# EAGLE design Comp PDU (EAGLE 9.5.2)
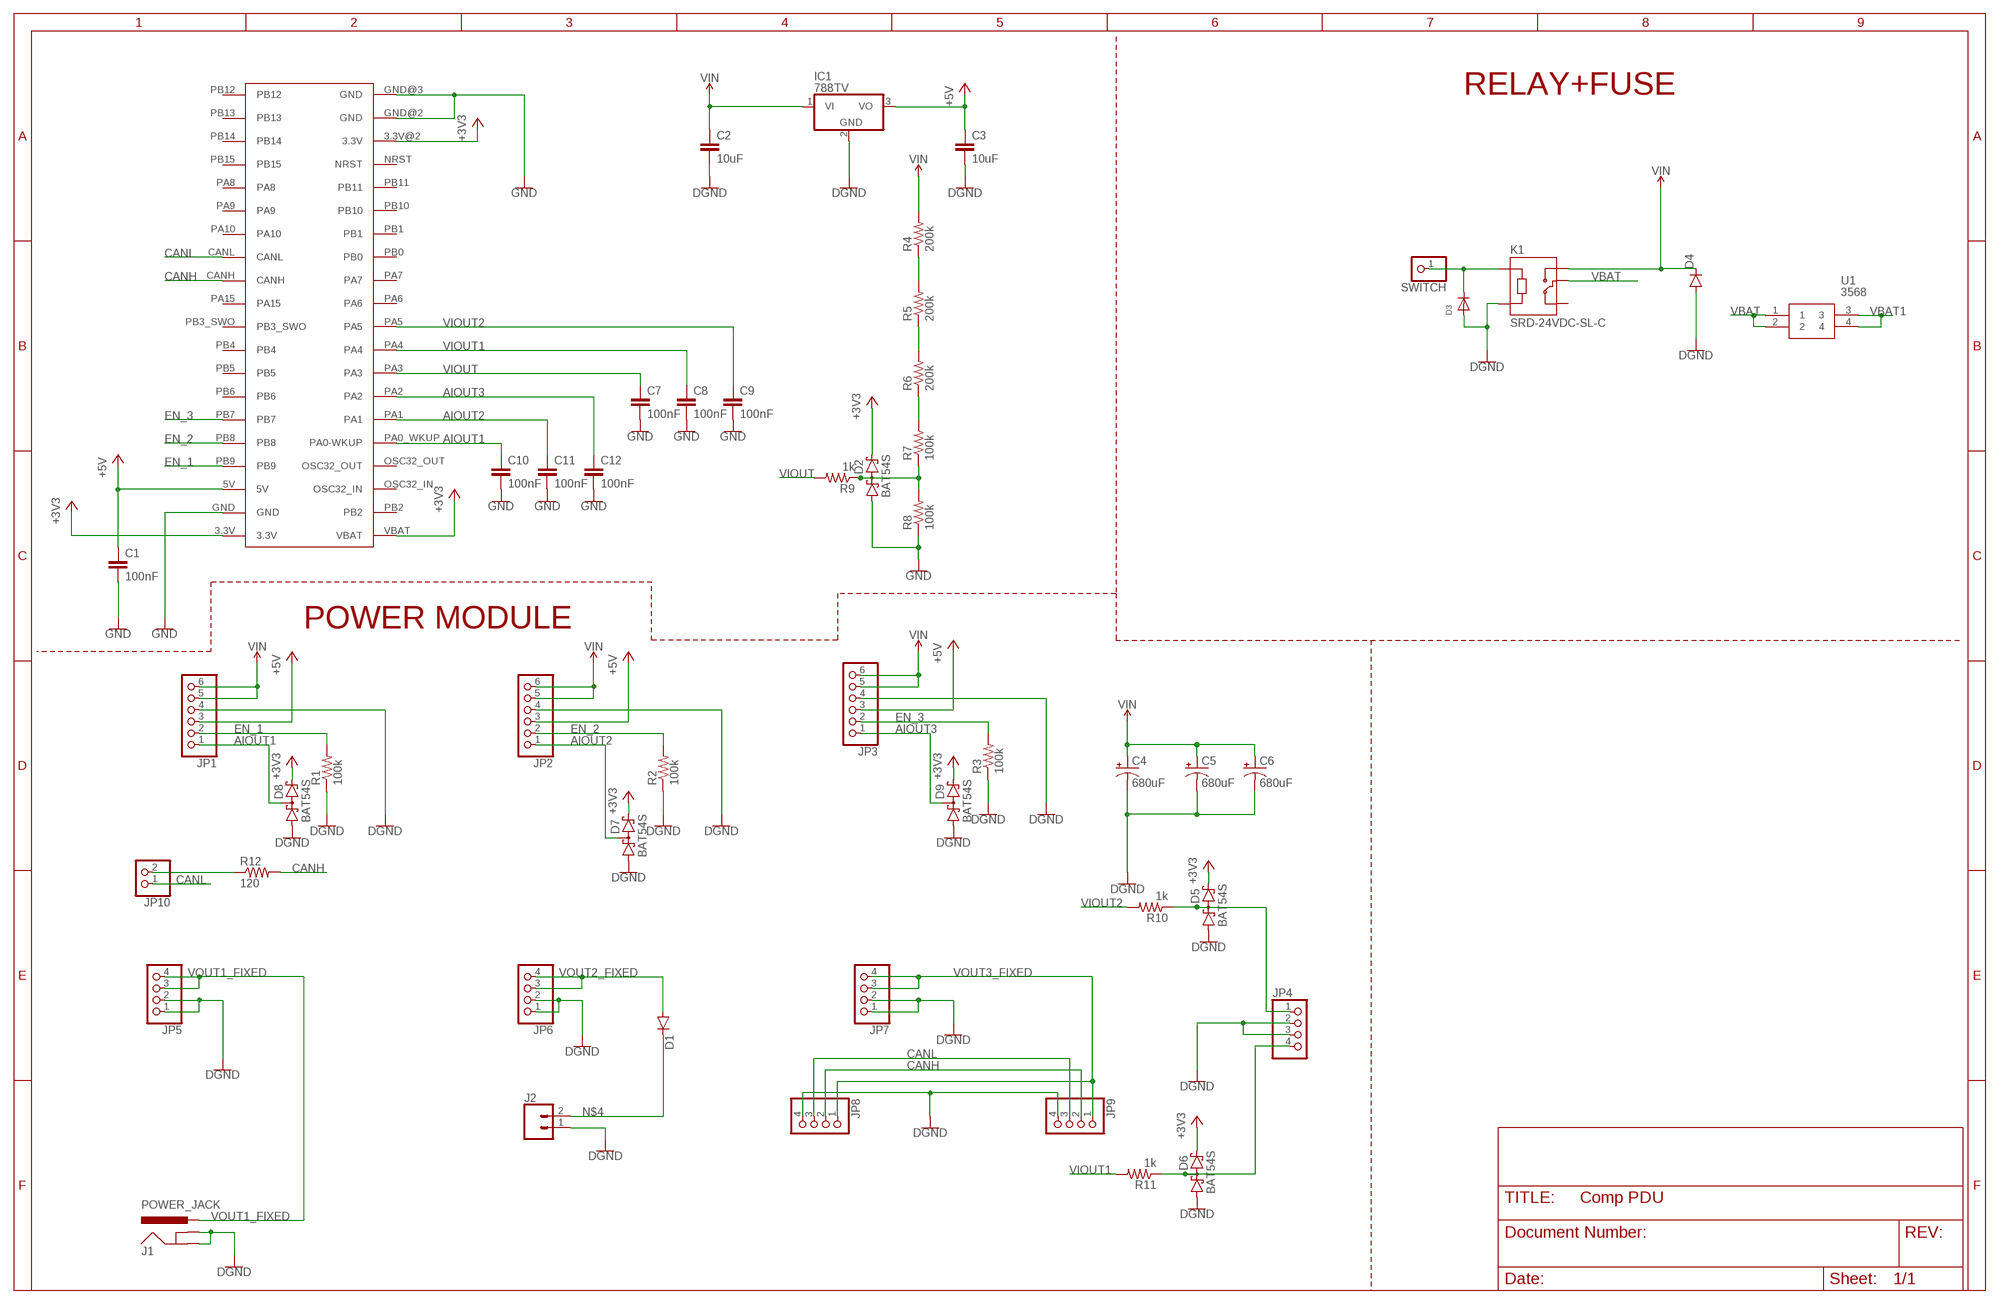
[diagram p0: schematic, sheet 1]

## Parts
C1  100nF  C-EUC0805  [C0805]
C2  10uF  C-EUC1206  [C1206]
C3  10uF  C-EUC1206  [C1206]
C4  680uF  CPOL-USE5-10.5  [E5-10,5]
C5  680uF  CPOL-USE5-10.5  [E5-10,5]
C6  680uF  CPOL-USE5-10.5  [E5-10,5]
C7  100nF  C-EUC0805  [C0805]
C8  100nF  C-EUC0805  [C0805]
C9  100nF  C-EUC0805  [C0805]
C10  100nF  C-EUC0805  [C0805]
C11  100nF  C-EUC0805  [C0805]
C12  100nF  C-EUC0805  [C0805]
D1  DIODE-DO214AA  [DO214AA]
D2  BAT54S  [SOT23]
D3  DIODEDO-1N4148  [DO-1N4148]
D4  DIODE-DO-214AC  [DO-214AC]
D5  BAT54S  [SOT23]
D6  BAT54S  [SOT23]
D7  BAT54S  [SOT23]
D8  BAT54S  [SOT23]
D9  BAT54S  [SOT23]
IC1  788TV  [TO220V]
J1  POWER_JACK  [POWER_JACK_PTH]
J2  CONN_025MM  [SCREWTERMINAL-5MM-2]
JP1  PINHD-1X6  [1X06]
JP2  PINHD-1X6  [1X06]
JP3  PINHD-1X6  [1X06]
JP4  PINHD-1X4  [1X04]
JP5  PINHD-1X4  [1X04]
JP6  PINHD-1X4  [1X04]
JP7  PINHD-1X4  [1X04]
JP8  PINHD-1X4  [1X04]
JP9  PINHD-1X4  [1X04]
JP10  PINHD-1X2  [1X02]
K1  SRD-24VDC-SL-C  SRD-05VDC-SL-C  [RELAY_SRD-05VDC-SL-C]
R1  100k  R-US_R0805  [R0805]
R2  100k  R-US_R0805  [R0805]
R3  100k  R-US_R0805  [R0805]
R4  200k  R-US_R0805  [R0805]
R5  200k  R-US_R0805  [R0805]
R6  200k  R-US_R0805  [R0805]
R7  100k  R-US_R0805  [R0805]
R8  100k  R-US_R0805  [R0805]
R9  1k  R-US_R0805  [R0805]
R10  1k  R-US_R0805  [R0805]
R11  1k  R-US_R0805  [R0805]
R12  120  R-US_R0805  [R0805]
SWITCH  PINHD-1X1  [1X01]
U1  3568  [3568]
U$1  STM-DEV-BOARD  [STM-DEV-BOARD]

## Nets
+3V3: D2.2(C2) D5.2(C2) D6.2(C2) D7.2(C2) D8.2(C2) D9.2(C2) U$1.3.3V U$1.3.3V@2(3.3V) U$1.VBAT
+5V: C1.1 C3.1 IC1.3(VO) JP1.3 JP2.3 JP3.3 U$1.5V
AIOUT1: C10.1 D8.3(C1A2) JP1.1 U$1.PA0_WKUP(PA0-WKUP)
AIOUT2: C11.1 D7.3(C1A2) JP2.1 U$1.PA1
AIOUT3: C12.1 D9.3(C1A2) JP3.1 U$1.PA2
CANH: JP8.2 JP9.2 R12.2 U$1.CANH
CANL: JP8.3 JP9.3 JP10.1 U$1.CANL
EN_1: JP1.2 R1.2 U$1.PB9
EN_2: JP2.2 R2.2 U$1.PB8
EN_3: JP3.2 R3.2 U$1.PB7
GND: C1.2 C2.2 C3.2 C4.- C5.- C6.- C7.2 C8.2 C9.2 C10.2 C11.2 C12.2 D2.1(A1) D3.A D4.A D5.1(A1) D6.1(A1) D7.1(A1) D8.1(A1) D9.1(A1) IC1.2(GND) J1.GND J1.GNDBREAK J2.1 JP1.4 JP2.4 JP3.4 JP4.2 JP4.3 JP5.1 JP5.2 JP6.1 JP6.2 JP7.1 JP7.2 JP8.4 JP9.4 K1.A2 R1.1 R2.1 R3.1 R8.1 U$1.GND U$1.GND@2(GND) U$1.GND@3(GND) ; supply symbol labelled DGND
N$1: R4.1 R5.2
N$2: R5.1 R6.2
N$3: R6.1 R7.2
N$4: D1.C J2.2
N$5: D2.3(C1A2) R7.1 R8.2 R9.1
N$6: JP10.2 R12.1
N$7: D3.C K1.A1 SWITCH.1
N$9: D6.3(C1A2) JP4.4 R11.1
N$13: D5.3(C1A2) JP4.1 R10.1
VBAT: K1.COM U1.1 U1.2
VBAT1: U1.3 U1.4
VIN: C2.1 C4.+ C5.+ C6.+ D4.C IC1.1(VI) JP1.5 JP1.6 JP2.5 JP2.6 JP3.5 JP3.6 K1.NO R4.2
VIOUT: C7.1 R9.2 U$1.PA3
VIOUT1: C8.1 R11.2 U$1.PA4
VIOUT2: C9.1 R10.2 U$1.PA5
VOUT1_FIXED: J1.PWR JP5.3 JP5.4
VOUT2_FIXED: D1.A JP6.3 JP6.4
VOUT3_FIXED: JP7.3 JP7.4 JP8.1 JP9.1
Unconnected: K1.NC U$1.NRST U$1.OSC32_IN U$1.OSC32_OUT U$1.PA6 U$1.PA7 U$1.PA8 U$1.PA9 U$1.PA10 U$1.PA15 U$1.PB0 U$1.PB1 U$1.PB2 U$1.PB3_SWO U$1.PB4 U$1.PB5 U$1.PB6 U$1.PB10 U$1.PB11 U$1.PB12 U$1.PB13 U$1.PB14 U$1.PB15

## Notes on the sheet
- RELAY+FUSE
- POWER MODULE

## Library data of the parts
C1-C3 C7-C12 = rcl:C-EU: CAPACITOR, European symbol; SPICEPREFIX: C
C4-C6 = rcl:CPOL-US: POLARIZED CAPACITOR, American symbol; SPICEPREFIX: C
D1 D4 = diode:DIODE-: DIODE
D2 D5-D9 = diode:BAT54S: Schottky Diodes Pin connection corrected 2011-05-04 Source: Fairchild .. BAT54.pdf
D3 = adafruit:DIODE: Diode SMADIODE - SMA Surface Mount Package 20V 1A Schottky Diode Digikey: 641-1014-6-ND DO-1N4148 - Through Hole Small Current Diode SOD-123 20V 1 A (.5mV Vf) Schottky Diode - Digikey: MBRX120TPMSCT-ND SOD-323 10V 570mA (.38mV Vf, 3ns) Schottky Diode - Digikey: ZLLS410CT-ND SOD-523 30V 30mA Schottky Diode (RB751S-40TE61) - Digikey: RB751S-40TE61CT-ND SOT23-R/W - SOT23 Package (R = Solder Paste/Reflow Ovens, W = Hand-Soldering) BAT54Film 40V 300mA - Digikey: 497-7162-1-ND
IC1 = linear:78*: Positive VOLTAGE REGULATOR Source: http://cache.national.com/ds/LM/LM78L05.pdf http://www.fairchildsemi.com/ds/LM/LM7805.pdf
J1 = SparkFun-Connectors:POWER_JACK: Power Jack Connector This is the standard 5.5mm barrel jack for power. The PTH is the most common, proven, reliable, footprint. The Slot footprint only works if the mill layer is transmitted to the PCB fab house so be warned. Here are the connectors we sell at SparkFun: DC Barrel Power Jack/Connector <https://www.sparkfun.com/products/119> (PRT-00119) DC Barrel Power Jack/Connector (SMD) <https://www.sparkfun.com/products/12748> (PRT-12748) DC Barrel Jack Adapter - Breadboard Compatible <https://www.sparkfun.com/products/10811> (PRT-10811) It is used on this SparkFun product (and many, many others): SparkFun RedBoard - Programmed with Arduino <https://www.sparkfun.com/products/12757> (DEV-12757) Also, if you need a mating power supply or connector, please check these out: Wall Adapter Power Supply - 9VDC 650mA <https://www.sparkfun.com/products/298> (TOL-00298) DC Barrel Jack Adapter - Male <https://www.sparkfun.com/products/10287> (PRT-10287); PROD_ID: CONN-08197
J2 = SparkFun-Connectors:CONN_02: Multi connection point. Often used as Generic Header-pin footprint for 0.1 inch spaced/style header connections On any of the 0.1 inch spaced packages, you can populate with these: Break Away Headers - Straight <https://www.sparkfun.com/products/116> (PRT-00116) Break Away Male Headers - Right Angle <https://www.sparkfun.com/products/553> (PRT-00553) Female Headers <https://www.sparkfun.com/products/115> (PRT-00115) Break Away Headers - Machine Pin <https://www.sparkfun.com/products/117> (PRT-00117) Break Away Female Headers - Swiss Machine Pin <https://www.sparkfun.com/products/743> (PRT-00743) For SCREWTERMINALS and SPRING TERMINALS visit here: Screw Terimnals on SparkFun.com <https://www.sparkfun.com/search/results?term=Screw+Terminals> (5mm/3.5mm/2.54mm spacing) This device is also useful as a general connection point to wire up your design to another part of your project. Our various solder wires solder well into these plated through hole pads. Hook-Up Wire - Assortment (Stranded, 22 AWG) <https://www.sparkfun.com/products/11375> (PRT-11375) Hook-Up Wire - Assortment (Solid Core, 22 AWG) <https://www.sparkfun.com/products/11367> (PRT-11367) View the entire wire category on our website here <https://www.sparkfun.com/categories/141> Special notes: Molex polarized connector foot print use with: PRT-08233 with associated crimp pins and housings. 2.54_SCREWTERM for use with PRT-10571. 3.5mm Screw Terminal footprints for PRT-08084 5mm Screw Terminal footprints for use with PRT-08432; SF_SKU: PRT-08432
JP1-JP3 = pinhead:PINHD-1X6: PIN HEADER
JP4-JP9 = pinhead:PINHD-1X4: PIN HEADER
JP10 = pinhead:PINHD-1X2: PIN HEADER
K1 = SPEAR:SRD-05VDC-SL-C: 5V Trigger Relay Module For Arduino And Raspberry Pi 5V Trigger Relay Module For Arduino And Raspberry Pi; AVAILABILITY: Unavailable; DESCRIPTION: 5V Trigger Relay Module For Arduino And Raspberry Pi 5V Trigger Relay Module For Arduino And Raspberry Pi; MF: Songle Relay; MP: SRD-05VDC-SL-C; PACKAGE: None; PRICE: None
R1-R12 = rcl:R-US_: RESISTOR, American symbol; SPICEPREFIX: R
SWITCH = pinhead:PINHD-1X1: PIN HEADER
U1 = LCSC:3568: Fuse Holder .63 MINI FUSE HOLDER Source: Datasheet <http://www.keyelco.com/product-pdf.cfm?p=306>; ALLIED_NUMBER: 70182434; ALLIED_PRICE-STOCK: http://www.alliedelec.com/keystone-electronics-3568/70182434/; DESCRIPTION: Fuse Holder .63 MINI FUSE HOLDER; HEIGHT: 7.37mm; MANUFACTURER_NAME: Keystone Electronics; MANUFACTURER_PART_NUMBER: 3568; MOUSER_PART_NUMBER: 534-3568; MOUSER_PRICE-STOCK: https://www.mouser.com/Search/Refine.aspx?Keyword=534-3568
U$1 = SPEAR:STM-DEV-BOARD: STM Dev board device for SPEAR custom board

## Board
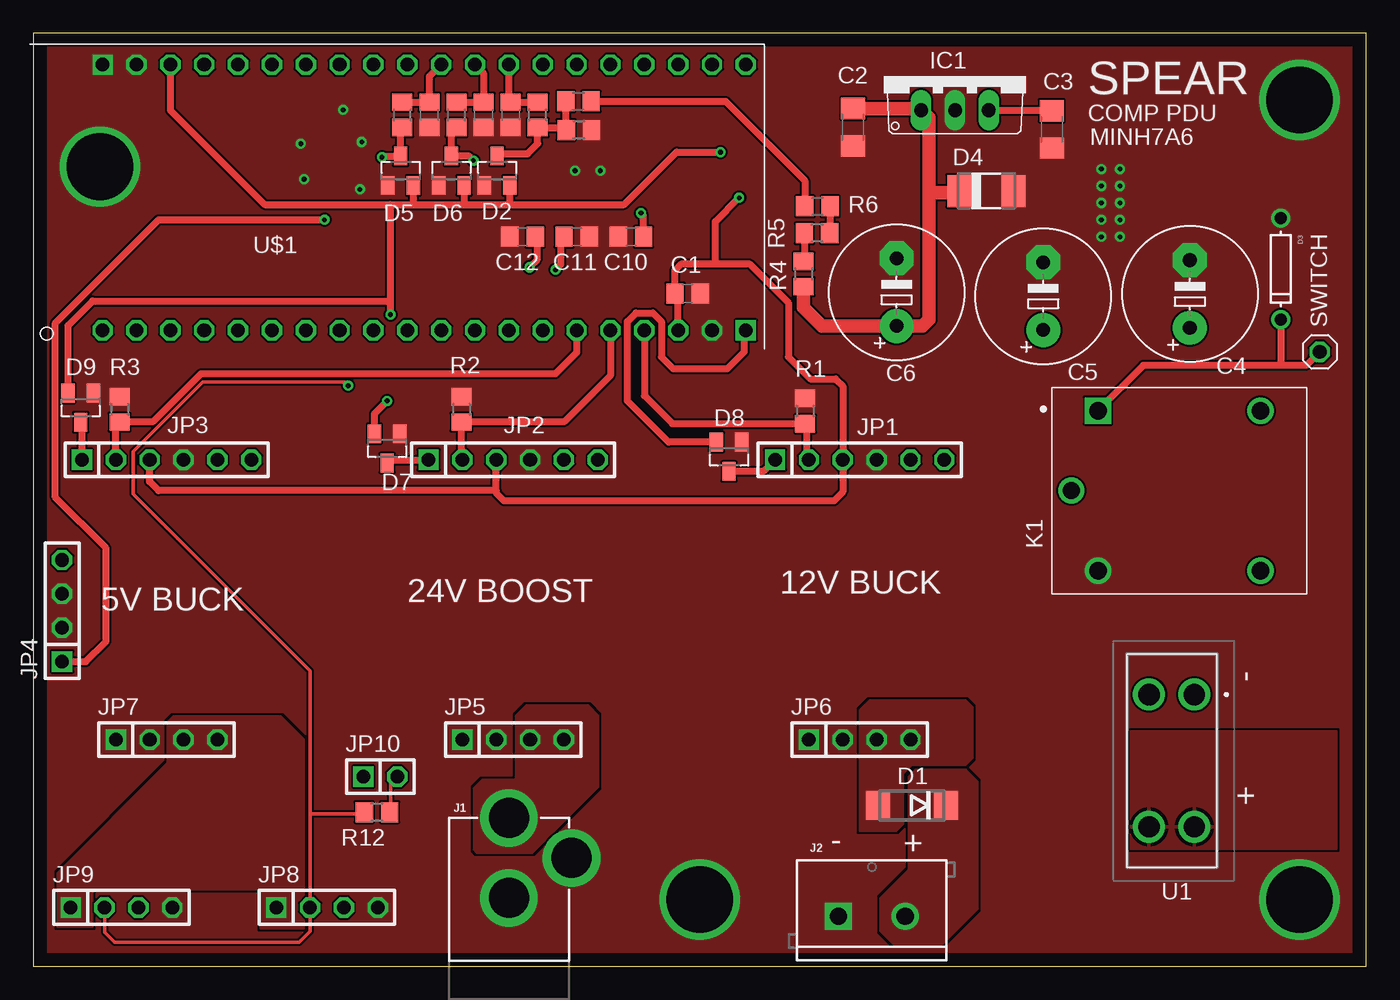
[diagram p1: board, top side]
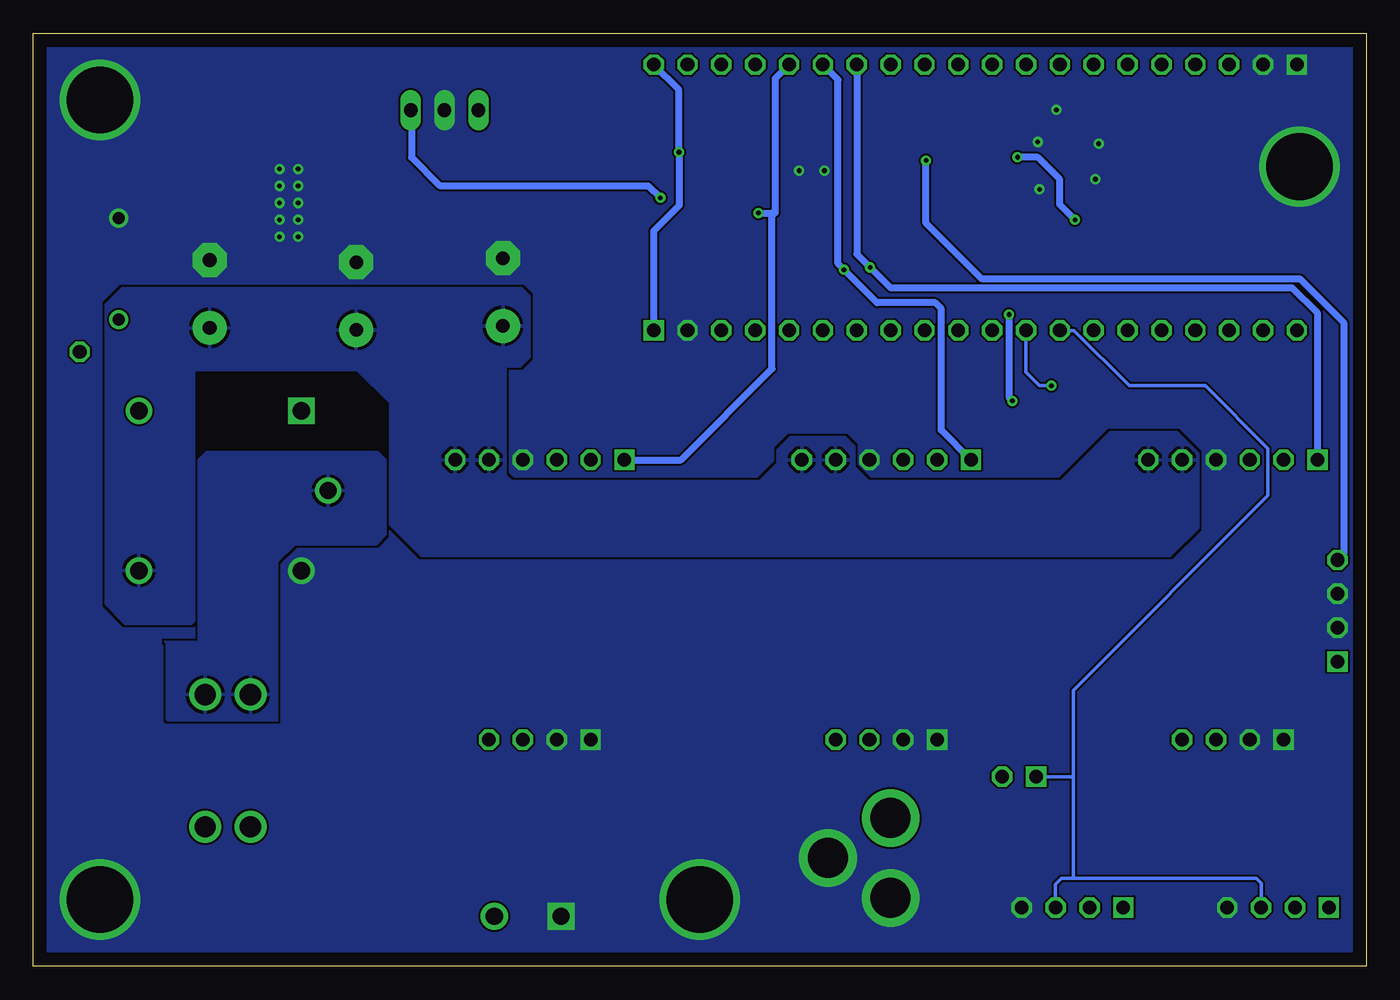
[diagram p2: board, bottom side, seen from below]

Size 100 x 70 mm. Coordinates in mm from the lower left corner, seen from the top.
Outline: 0,0 100,0 100,70 0,70 0,0
Copper layers (1*16): Top 0.035mm / dielectric 1.5mm / Bottom 0.035mm
Design rules "default *": minimum track width 6mil, minimum drill 0.35mm, track to track 6mil, track to pad 6mil, pad to pad 6mil, via to via 6mil, smd to smd 6mil, copper to edge 40mil, drill to drill 6mil, minimum pad ring 10mil, minimum via ring 8mil, stop-mask expansion 4mil, vias tented up to drill 20mil, thermal gap 10mil

### Footprints (pad centres in the part's own frame; a part is rotated, then mirrored left to right if it is on the bottom)
C0805 = smd 1.3 x 1.5: 1 -0.95,0; 2 0.95,0
C1206 = smd 1.6 x 1.8: 1 -1.4,0; 2 1.4,0
E5-10,5 = drill 1.016 pad 2.54: + -2.54,0 | drill 1.016 pad 2.54 octagon: - 2.54,0
DO214AA = smd 1.8 x 2.2: A 2.55,0; C -2.55,0
SOT23 = smd 1 x 1.4: 1 -0.95,-1.1; 2 0.95,-1.1; 3 0,1.1
DO-1N4148 = drill 0.9: A -3.81,0; C 3.81,0
DO-214AC = smd 1.8 x 2.4: A 2.025,0; C -2.025,0
TO220V = drill 1.016 long: 1 -2.54,-2.54; 2 0,-2.54; 3 2.54,-2.54
POWER_JACK_PTH = drill 2.997 pad 4.318: GND 0,7.7; GNDBREAK 4.7,10.7; PWR 0,13.7
SCREWTERMINAL-5MM-2 = drill 1.3 pad 2.032 square: 1 0,0 | drill 1.3 pad 2.032: 2 5,0
1X06 = drill 1.016 square: 1 -6.35,0 | drill 1.016 octagon: 2 -3.81,0; 3 -1.27,0; 4 1.27,0; 5 3.81,0; 6 6.35,0
1X04 = drill 1.016 square: 1 -3.81,0 | drill 1.016 octagon: 2 -1.27,0; 3 1.27,0; 4 3.81,0
1X02 = drill 1.016 square: 1 -1.27,0 | drill 1.016 octagon: 2 1.27,0
RELAY_SRD-05VDC-SL-C = drill 1.32 square: A1 -6.1,6 | drill 1.32: A2 -6.1,-6; NC 6.1,6; NO 6.1,-6 | drill 1.29: COM -8.1,0
R0805 = smd 1.3 x 1.5: 1 -0.95,0; 2 0.95,0
1X01 = drill 1.016 octagon: 1 0,0
3568 = drill 1.6 pad 2.4: 1 0,0; 2 0,-3.4; 3 9.92,0; 4 9.92,-3.4
STM-DEV-BOARD = drill 1.016 square: 3.3V -10.16,-24.13; GND@3 9.779,24.13 | drill 1.016 octagon: 3.3V@2 9.779,19.05; 5V -10.16,-19.05; CANH -10.16,3.81; CANL -10.16,6.35; GND -10.16,-21.59; GND@2 9.779,21.59; NRST 9.779,16.51; OSC32_IN 9.779,-19.05; OSC32_OUT 9.779,-16.51; PA0_WKUP 9.779,-13.97; PA1 9.779,-11.43; PA2 9.779,-8.89; PA3 9.779,-6.35; PA4 9.779,-3.81; PA5 9.779,-1.27; PA6 9.779,1.27; PA7 9.779,3.81; PA8 -10.16,13.97; PA9 -10.16,11.43; PA10 -10.16,8.89; PA15 -10.16,1.27; PB0 9.779,6.35; PB1 9.779,8.89; PB2 9.779,-21.59; PB3_SWO -10.16,-1.27; PB4 -10.16,-3.81; PB5 -10.16,-6.35; PB6 -10.16,-8.89; PB7 -10.16,-11.43; PB8 -10.16,-13.97; PB9 -10.16,-16.51; PB10 9.779,11.43; PB11 9.779,13.97; PB12 -10.16,24.13; PB13 -10.16,21.59; PB14 -10.16,19.05; PB15 -10.16,16.51; VBAT 9.779,-24.13

### Placement (x,y rotation side)
C1  49.09,50.47 0 top
C2  61.5,62.96 270 top
C3  76.41,62.79 270 top
C4  86.77,50.44 90 top
C5  75.77,50.28 90 top
C6  64.77,50.58 90 top
C7  35.81,63.88 270 top
C8  33.78,63.88 270 top
C9  29.72,63.88 270 top
C10  44.83,54.74 180 top
C11  40.77,54.74 0 top
C12  36.7,54.74 180 top
D1  65.91,12.06 180 top
D2  34.8,59.69 0 top
D3  93.6,52.32 270 top
D4  71.5,58.17 0 top
D5  27.56,59.69 0 top
D6  31.37,59.69 0 top
D7  26.54,38.86 180 top
D8  52.2,38.23 180 top
D9  3.56,41.91 180 top
IC1  69.15,66.77 0 top
J1  35.68,-2.58 0 top
J2  60.41,3.74 0 top
JP1  62,38 0 top
JP2  36,38 0 top
JP3  10,38 0 top
JP4  2.16,26.67 90 top
JP5  36,17 0 top
JP6  62,17 0 top
JP7  10,17 0 top
JP8  22.03,4.41 0 top
JP9  6.61,4.41 0 top
JP10  26.04,14.22 0 top
K1  85.98,35.69 0 top
R1  57.91,41.66 270 top
R2  32.13,41.78 270 top
R3  6.48,41.78 270 top
R4  57.78,51.94 270 top
R5  58.8,54.99 180 top
R6  58.83,57.02 0 top
R7  40.89,64.9 0 top
R8  40.93,62.74 180 top
R9  37.85,63.88 90 top
R10  27.69,63.88 90 top
R11  31.75,63.88 90 top
R12  25.78,11.56 180 top
SWITCH  96.52,46.1 0 top
U1  87.11,20.38 270 top
U$1  29.33,57.87 90 top

### Tracks (layer width: path | path; a pad name or v marks a point on that pad's centre or on a via)
+3V3  (via drill 0.35)
  Top 0.508: U$1.3.3V@2 10.28,64.22 17.35,57.15 26.8,57.15 | v51.56,61.09 48.26,61.09 44.32,57.15 35.69,57.15 | 26.8,57.15 28.57,57.15 | 28.57,57.15 32.26,57.15 | 32.26,57.15 35.69,57.15 | D2.2 35.75,57.21 35.69,57.15 | D6.2 32.32,57.21 32.26,57.15 | D5.2 28.51,57.22 28.57,57.15 | D8.2 47.67,39.33 44.58,42.42 44.58,48.39 45.21,49.02 46.48,49.02 47.12,48.39 47.12,45.72 48.01,44.83 52.07,44.83 53.34,46.1 53.34,47.59 U$1.3.3V | D7.2 25.59,41.47 v26.54,42.42 | v26.8,48.9 26.8,49.91 | 26.8,49.91 26.8,57.15 | D9.2 2.61,48.07 4.45,49.91 26.8,49.91
  Bottom 0.508: U$1.VBAT 51.56,65.75 v51.56,61.09 51.54,61.06 51.54,57.08 53.46,55.16 U$1.3.3V | v26.8,48.9 26.8,42.67 v26.54,42.42
+5V  (via drill 0.35)
  Top 0.508: U$1.5V 48.38,50.23 C1.1 48.14,52.2 48.64,52.7 51.18,52.7 | IC1.3 76.37,64.23 C3.1 | 51.18,52.7 53.72,52.7 56.64,49.78 56.64,45.72 58.29,44.07 60.2,44.07 60.73,43.54 JP1.3 60.73,35.58 60.07,34.92 35.31,34.92 34.73,35.5 34.73,35.69 | 34.73,35.69 JP2.3 | 34.73,35.69 9.4,35.69 8.73,36.35 JP3.3 | 51.18,52.7 51.18,55.88 v52.96,57.66
  Bottom 0.508: v52.96,57.66 53.85,58.55 69.47,58.55 71.63,60.71 71.63,64.17 IC1.3
AIOUT1  (via drill 0.35)
  Top 0.508: JP1.1 54.78,37.13 D8.3 | C10.1 45.78,56.33 v45.59,56.52
  Bottom 0.508: JP1.1 51.41,38 44.58,44.83 44.58,56.52 | U$1.PA0_WKUP 44.32,66.63 44.32,56.52 44.58,56.52 | v45.59,56.52 44.58,56.52
AIOUT2  (via drill 0.35)
  Top 0.508: D7.3 26.78,38 JP2.1 | C11.1 39.56,54.48 39.56,52.64 v39.18,52.26
  Bottom 0.508: JP2.1 31.88,40.23 31.88,49.33 32.33,49.78 36.7,49.78 v39.18,52.26 39.62,52.7 39.62,66.51 U$1.PA1
AIOUT3  (via drill 0.35)
  Top 0.508: JP3.1 3.65,40.72 D9.3 | C12.1 37.78,54.61 37.78,52.99 v37.22,52.44
  Bottom 0.508: JP3.1 3.65,48.99 5.56,50.9 35.69,50.9 v37.22,52.44 38.22,53.44 U$1.PA2
CANH  (via drill 0.35)
  Top 0.254: JP9.2 5.34,2.53 6.1,1.78 19.94,1.78 20.76,2.6 JP8.2 20.76,11.43 | 20.76,11.43 20.76,22.16 7.49,35.43 7.49,38.62 12.69,43.81 23.37,43.81 v23.62,43.56 | R12.2 24.7,11.43 20.76,11.43
  Bottom 0.254: v23.62,43.56 24.51,43.56 25.52,44.57 U$1.CANH
CANL
  Bottom 0.254: JP9.3 7.88,6.23 8.26,6.6 21.97,6.6 | JP8.3 23.3,6.16 22.86,6.6 21.97,6.6 | 21.97,6.6 21.97,14.22 | 21.97,14.22 21.97,20.7 7.37,35.31 7.37,38.86 12.06,43.56 17.78,43.56 21.93,47.71 U$1.CANL | JP10.1 21.97,14.22
EN_1
  Top 0.508: JP1.2 58.04,38.15 58.04,40.58 R1.2 47.94,40.71 45.84,42.81 U$1.PB9
EN_2
  Top 0.508: JP2.2 32.13,38.06 R2.2 39.82,40.83 43.3,44.32 U$1.PB8
EN_3
  Top 0.508: U$1.PB7 40.76,46.06 39.15,44.45 12.57,44.45 8.96,40.83 R3.2 6.19,40.55 JP3.2
GND  (via drill 0.35, 5)
  other vias: 95,5 95,65 5,60 50,5 80.14,59.82 81.53,59.82 81.53,58.55 80.14,58.55 80.14,57.28 81.53,57.28 80.14,56.01 81.53,56.01 81.53,54.74 80.14,54.74 23.24,64.26 20.07,61.72 20.32,59.05 40.64,59.69 24.64,61.85 42.55,59.69 24.51,58.29
  pour Top (rank 6, no thermals): -1.27,-1.27 101.6,-1.27 101.6,71.12 -1.27,71.12
  pour Bottom (rank 6, no thermals): -3.81,-1.27 102.87,-1.27 102.87,71.12 -3.81,71.12
N$1
  Top 0.508: R5.2 57.85,52.96 R4.1
N$2
  Top 0.508: R6.2 59.78,55.02 R5.1
N$3
  Top 0.508: R7.2 51.94,64.9 57.88,58.96 R6.1
N$4
  pour Top (no thermals): 65.66,14.22 65.66,7.24 63.5,5.08 63.5,2.67 64.52,1.65 68.2,1.65 70.87,4.32 70.87,13.84 69.98,14.73 66.17,14.73
N$5
  Top 0.508: R7.1 39.98,64.86 R8.2 39.78,62.93 R9.1 37.85,61.72 37.08,60.96 34.97,60.96 D2.3
N$6
  Top 0.254: R12.1 26.8,11.62 26.8,13.72 JP10.2
N$7
  Top 0.508: K1.A1 83.28,45.09 93.73,45.09 | SWITCH.1 95.5,45.09 93.73,45.09 | D3.C 93.6,45.21 93.73,45.09
N$9  (via drill 0.35)
  Top 0.508: v33.02,60.45 32.68,60.79 D6.3 31.37,62.55 R11.1
  Bottom 0.508: JP4.4 1.65,30.99 1.65,48.25 4.96,51.56 28.83,51.56 33.02,55.75 v33.02,60.45
N$13  (via drill 0.35)
  Top 0.508: R10.1 27.56,62.8 D5.3 26.25,60.79 v26.16,60.71 | JP4.1 3.94,22.86 5.46,24.38 5.46,31.37 1.65,35.18 1.65,48.26 9.4,56.01 v21.84,56.01
  Bottom 0.508: v21.84,56.01 22.99,57.15 22.99,59.05 24.64,60.71 v26.16,60.71
VBAT
  pour Bottom (rank 2): 81.66,18.41 89.92,18.41 90.04,18.54 90.04,24.26 90.17,24.38 87.63,24.38 87.63,37.97 87,38.61 74.17,38.61 73.53,37.97 73.53,32.38 74.3,31.62 80.39,31.62 81.66,30.35
VBAT1
  pour Top: 82.3,8.76 82.3,17.65 97.79,17.65 97.79,8.76
VIN
  Top 1.016: C2.1 66.48,64.36 IC1.1 67.18,63.66 67.18,57.91 | 67.18,57.91 67.18,48.51 66.71,48.04 C6.+ 59.18,48.04 57.78,49.44 R4.2 | 67.18,57.91 67.31,58.04 69.35,58.04 D4.C
  pour Bottom: 88.14,25.65 93.09,25.65 94.61,27.18 94.61,49.66 93.34,50.93 63.37,50.93 62.74,50.29 62.74,45.72 63.5,44.96 64.52,44.96 64.52,36.83 64.14,36.45 45.47,36.45 44.2,37.72 44.2,38.73 43.18,39.75 39.12,39.75 38.35,38.99 38.35,37.47 37.34,36.45 22.86,36.45 19.18,40.13 14.22,40.13 12.57,38.48 12.57,32.89 14.73,30.73 70.87,30.73 73.28,33.15 73.28,42.29 75.69,44.7 87.88,44.7 87.88,25.91
VIOUT
  Top 0.508: R9.2 C7.1 35.68,64.97 U$1.PA3
VIOUT1
  Top 0.508: R11.2 C8.1 33.77,67.01 U$1.PA4
VIOUT2
  Top 0.508: R10.2 C9.1 29.72,66.77 U$1.PA5
VOUT1_FIXED
  pour Top (no thermals): 36.2,18.54 36.2,14.1 36.07,13.97 33.66,13.97 33.02,13.34 33.02,8.76 33.27,8.51 37.47,8.51 42.42,13.46 42.42,18.8 41.66,19.56 36.96,19.56 36.2,18.8
VOUT2_FIXED
  pour Top (no thermals): 61.98,10.16 64.77,10.16 65.28,10.67 65.28,14.48 65.91,15.11 69.98,15.11 70.48,15.62 70.48,19.43 69.98,19.94 62.74,19.94 61.98,19.18
VOUT3_FIXED
  pour Top (no thermals): 1.78,2.92 4.45,2.92 4.45,5.71 16.89,5.71 17.02,5.59 17.02,2.79 20.32,2.79 20.32,17.02 18.54,18.8 10.54,18.8 10.03,18.29 10.03,15.24 1.78,6.99

### Text on the board
tPlace: SPEAR | COMP PDU | MINH7A6 | 12V BUCK | 5V BUCK | 24V BOOST | - | + | - | +